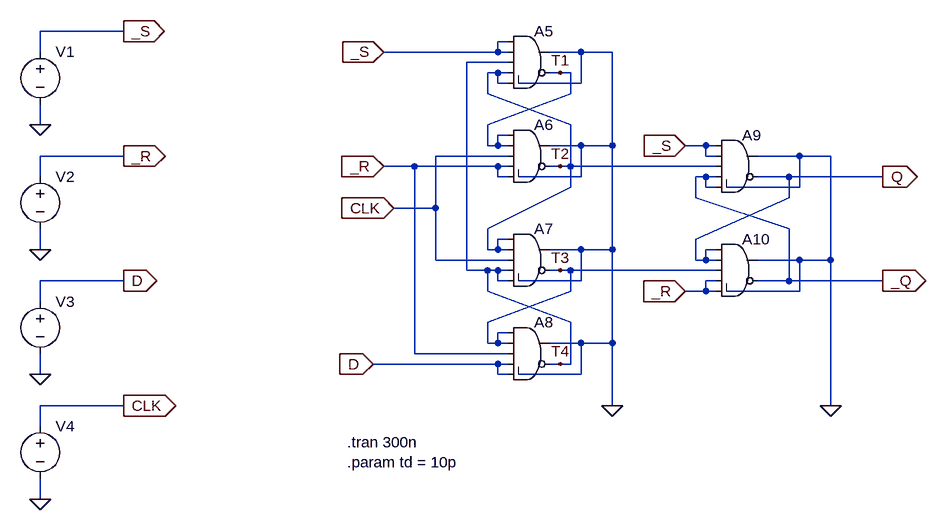
[diagram p0: schematic ff-asr[gates].asc]
ff-asr[gates].asc, the LTspice schematic file:
Version 4
SHEET 1 1096 680
WIRE -288 -832 -416 -832
WIRE 304 -816 288 -816
WIRE -416 -800 -416 -832
WIRE 288 -800 288 -816
WIRE 288 -800 112 -800
WIRE 304 -800 288 -800
WIRE 416 -800 368 -800
WIRE 464 -800 416 -800
WIRE 304 -784 240 -784
WIRE 288 -768 272 -768
WIRE 304 -768 288 -768
WIRE 384 -768 368 -768
WIRE 400 -768 384 -768
WIRE 288 -752 288 -768
WIRE 304 -752 288 -752
WIRE 416 -752 416 -800
WIRE 416 -752 320 -752
WIRE 272 -736 272 -768
WIRE 400 -736 400 -768
WIRE -416 -688 -416 -720
WIRE 272 -688 400 -736
WIRE 400 -688 272 -736
WIRE 304 -672 288 -672
WIRE 272 -656 272 -688
WIRE 288 -656 288 -672
WIRE 288 -656 272 -656
WIRE 304 -656 288 -656
WIRE 416 -656 368 -656
WIRE 464 -656 464 -800
WIRE 464 -656 416 -656
WIRE 608 -656 576 -656
WIRE 624 -656 608 -656
WIRE -288 -640 -416 -640
WIRE 304 -640 192 -640
WIRE 608 -640 608 -656
WIRE 624 -640 608 -640
WIRE 752 -640 688 -640
WIRE 800 -640 752 -640
WIRE 160 -624 112 -624
WIRE 288 -624 160 -624
WIRE 304 -624 288 -624
WIRE 384 -624 368 -624
WIRE 400 -624 400 -688
WIRE 400 -624 384 -624
WIRE 624 -624 400 -624
WIRE -416 -608 -416 -640
WIRE 288 -608 288 -624
WIRE 304 -608 288 -608
WIRE 416 -608 416 -656
WIRE 416 -608 320 -608
WIRE 608 -608 592 -608
WIRE 624 -608 608 -608
WIRE 736 -608 688 -608
WIRE 880 -608 736 -608
WIRE 400 -592 400 -624
WIRE 608 -592 608 -608
WIRE 624 -592 608 -592
WIRE 752 -592 752 -640
WIRE 752 -592 640 -592
WIRE 592 -576 592 -608
WIRE 736 -576 736 -608
WIRE 192 -560 192 -640
WIRE 192 -560 128 -560
WIRE 272 -528 400 -592
WIRE 736 -528 592 -576
WIRE 304 -512 288 -512
WIRE 592 -512 736 -576
WIRE -416 -496 -416 -528
WIRE 272 -496 272 -528
WIRE 288 -496 288 -512
WIRE 288 -496 272 -496
WIRE 304 -496 288 -496
WIRE 416 -496 368 -496
WIRE 464 -496 464 -656
WIRE 464 -496 416 -496
WIRE 624 -496 608 -496
WIRE 192 -480 192 -560
WIRE 304 -480 192 -480
WIRE 592 -480 592 -512
WIRE 608 -480 608 -496
WIRE 608 -480 592 -480
WIRE 624 -480 608 -480
WIRE 752 -480 688 -480
WIRE 800 -480 800 -640
WIRE 800 -480 752 -480
WIRE 240 -464 240 -784
WIRE 272 -464 240 -464
WIRE 288 -464 272 -464
WIRE 304 -464 288 -464
WIRE 384 -464 368 -464
WIRE 400 -464 384 -464
WIRE 624 -464 400 -464
WIRE -288 -448 -416 -448
WIRE 288 -448 288 -464
WIRE 304 -448 288 -448
WIRE 416 -448 416 -496
WIRE 416 -448 320 -448
WIRE 624 -448 608 -448
WIRE 736 -448 736 -528
WIRE 736 -448 688 -448
WIRE 880 -448 736 -448
WIRE 272 -432 272 -464
WIRE 400 -432 400 -464
WIRE 608 -432 608 -448
WIRE 608 -432 576 -432
WIRE 624 -432 608 -432
WIRE 752 -432 752 -480
WIRE 752 -432 640 -432
WIRE -416 -416 -416 -448
WIRE 272 -384 400 -432
WIRE 400 -384 272 -432
WIRE 304 -368 288 -368
WIRE 272 -352 272 -384
WIRE 288 -352 288 -368
WIRE 288 -352 272 -352
WIRE 304 -352 288 -352
WIRE 416 -352 368 -352
WIRE 464 -352 464 -496
WIRE 464 -352 416 -352
WIRE 160 -336 160 -624
WIRE 304 -336 160 -336
WIRE 288 -320 96 -320
WIRE 304 -320 288 -320
WIRE 384 -320 368 -320
WIRE 400 -320 400 -384
WIRE 400 -320 384 -320
WIRE -416 -304 -416 -336
WIRE 288 -304 288 -320
WIRE 304 -304 288 -304
WIRE 416 -304 416 -352
WIRE 416 -304 320 -304
WIRE -288 -256 -416 -256
WIRE 464 -256 464 -352
WIRE 800 -256 800 -480
WIRE -416 -224 -416 -256
WIRE -416 -112 -416 -144
FLAG -288 -832 _S
IOPIN -288 -832 Out
FLAG 112 -800 _S
IOPIN 112 -800 In
FLAG 128 -560 CLK
IOPIN 128 -560 In
FLAG 112 -624 _R
IOPIN 112 -624 In
FLAG 96 -320 D
IOPIN 96 -320 In
FLAG 384 -624 T2
FLAG 384 -464 T3
FLAG 384 -320 T4
FLAG 384 -768 T1
FLAG 576 -432 _R
IOPIN 576 -432 In
FLAG 576 -656 _S
IOPIN 576 -656 In
FLAG 464 -256 0
FLAG 800 -256 0
FLAG 880 -608 Q
IOPIN 880 -608 Out
FLAG 880 -448 _Q
IOPIN 880 -448 Out
FLAG -416 -688 0
FLAG -288 -640 _R
IOPIN -288 -640 Out
FLAG -416 -496 0
FLAG -288 -448 D
IOPIN -288 -448 Out
FLAG -416 -304 0
FLAG -288 -256 CLK
IOPIN -288 -256 Out
FLAG -416 -112 0
SYMBOL Digital\\and 336 -848 R0
WINDOW 3 16 52 Invisible 2
SYMATTR Value td={td}
SYMATTR InstName A5
SYMBOL Digital\\and 336 -704 R0
WINDOW 3 16 52 Invisible 2
SYMATTR Value td={td}
SYMATTR InstName A6
SYMBOL Digital\\and 336 -544 R0
WINDOW 3 16 52 Invisible 2
SYMATTR Value td={td}
SYMATTR InstName A7
SYMBOL Digital\\and 336 -400 R0
WINDOW 3 16 52 Invisible 2
SYMATTR Value td={td}
SYMATTR InstName A8
SYMBOL Digital\\and 656 -688 R0
WINDOW 3 16 52 Invisible 2
SYMATTR Value td={td}
SYMATTR InstName A9
SYMBOL Digital\\and 656 -528 R0
WINDOW 3 0 0 Invisible 2
SYMATTR Value td={td}
SYMATTR InstName A10
SYMBOL voltage -416 -816 R0
WINDOW 123 0 0 Left 2
WINDOW 39 0 0 Left 2
WINDOW 3 24 96 Invisible 2
SYMATTR InstName V1
SYMATTR Value PWL file=ff-asr[gates][s].pwl
SYMBOL voltage -416 -624 R0
WINDOW 123 0 0 Left 2
WINDOW 39 0 0 Left 2
WINDOW 3 24 96 Invisible 2
SYMATTR InstName V2
SYMATTR Value PWL file=ff-asr[gates][r].pwl
SYMBOL voltage -416 -432 R0
WINDOW 3 24 96 Invisible 2
SYMATTR InstName V3
SYMATTR Value PWL repeat forever (file=ff-asr[gates][d].pwl) endrepeat
SYMBOL voltage -416 -240 R0
WINDOW 3 24 96 Invisible 2
SYMATTR InstName V4
SYMATTR Value PWL repeat forever (file=ff-asr[gates][clk].pwl) endrepeat
TEXT 56 -200 Left 2 !.tran 300n\n.param td = 10p

The netlist it stands for:
* ff-asr[gates].asc
A5 _S _S T4 T2 T2 T1 0 0 AND td={td}
A6 T1 T1 CLK _R _R T2 0 0 AND td={td}
A7 T2 T2 CLK T4 T4 T3 0 0 AND td={td}
A8 T3 T3 _R D D T4 0 0 AND td={td}
A9 _S _S T2 _Q _Q Q 0 0 AND td={td}
A10 Q Q T3 _R _R _Q 0 0 AND td={td}
V1 _S 0 PWL file=ff-asr[gates][s].pwl
V2 _R 0 PWL file=ff-asr[gates][r].pwl
V3 D 0 PWL repeat forever (file=ff-asr[gates][d].pwl) endrepeat
V4 CLK 0 PWL repeat forever (file=ff-asr[gates][clk].pwl) endrepeat
.tran 300n
.param td = 10p
.backanno
.end